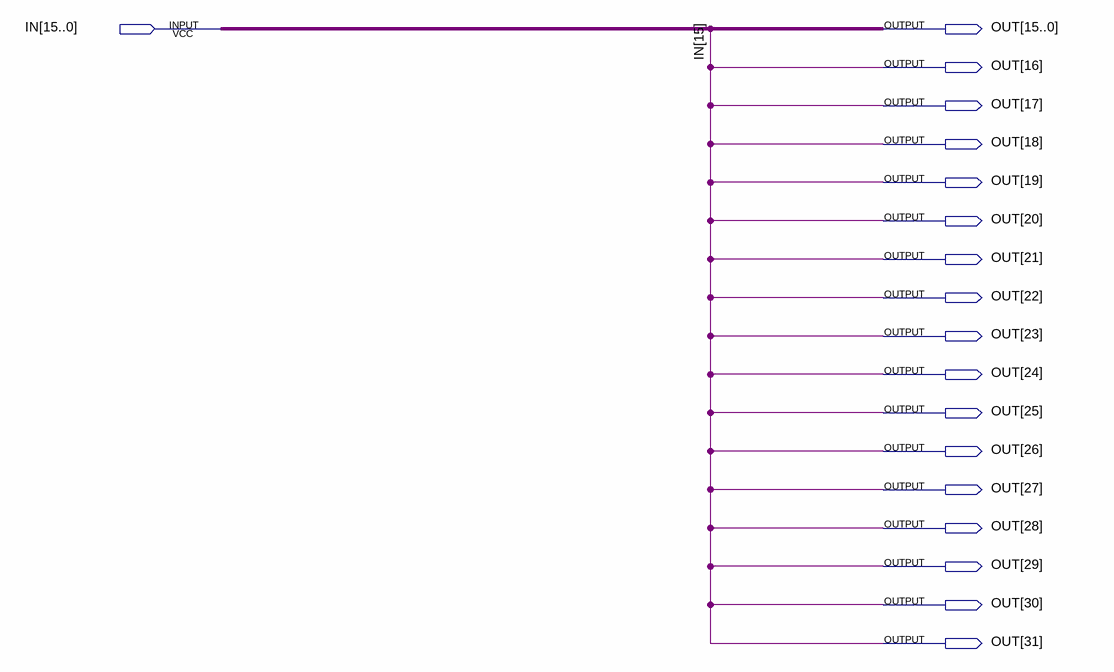
[diagram p0: schematic sheet]
// Quartus schematic SignExtend.bdf as structural Verilog: 0 symbols, 18 pins
module SignExtend (
  input  [15:0] IN,
  output [31:0] OUT
);


  assign OUT = {{17{IN[15]}}, IN[14:0]};
endmodule
